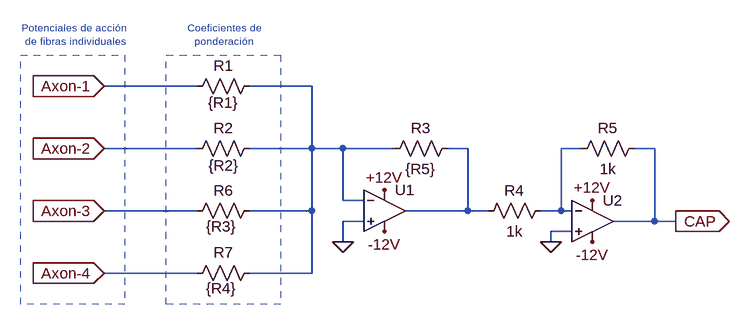
[diagram p0: schematic Modulo-Sumador.asc]
Modulo-Sumador.asc, the LTspice schematic file:
Version 4
SHEET 1 880 680
WIRE -80 64 -224 64
WIRE 96 64 0 64
WIRE -80 160 -224 160
WIRE 96 160 96 64
WIRE 96 160 0 160
WIRE 144 160 96 160
WIRE 224 160 144 160
WIRE 336 160 304 160
WIRE 512 160 480 160
WIRE 624 160 592 160
WIRE 144 240 144 160
WIRE 176 240 144 240
WIRE -80 256 -224 256
WIRE 96 256 96 160
WIRE 96 256 0 256
WIRE 336 256 336 160
WIRE 336 256 240 256
WIRE 368 256 336 256
WIRE 480 256 480 160
WIRE 480 256 448 256
WIRE 496 256 480 256
WIRE 176 272 144 272
WIRE 624 272 624 160
WIRE 624 272 560 272
WIRE 656 272 624 272
WIRE 496 288 464 288
WIRE 144 304 144 272
WIRE 464 304 464 288
WIRE -80 352 -224 352
WIRE 96 352 96 256
WIRE 96 352 0 352
FLAG 144 304 0
FLAG 208 224 +12V
FLAG 208 288 -12V
FLAG 528 240 +12V
FLAG 528 304 -12V
FLAG 464 304 0
FLAG 656 272 CAP
IOPIN 656 272 Out
FLAG -224 64 Axon-1
IOPIN -224 64 In
FLAG -224 160 Axon-2
IOPIN -224 160 In
FLAG -224 256 Axon-3
IOPIN -224 256 In
FLAG -224 352 Axon-4
IOPIN -224 352 In
SYMBOL res 16 48 R90
WINDOW 0 0 56 VBottom 2
WINDOW 3 57 56 VBottom 2
SYMATTR InstName R1
SYMATTR Value {R1}
SYMBOL res 16 144 R90
WINDOW 0 0 56 VBottom 2
WINDOW 3 58 55 VBottom 2
SYMATTR InstName R2
SYMATTR Value {R2}
SYMBOL res 320 144 R90
WINDOW 0 0 56 VBottom 2
WINDOW 3 32 56 VTop 2
SYMATTR InstName R3
SYMATTR Value {R5}
SYMBOL OpAmps\\UniversalOpAmp2 208 256 R0
SYMATTR InstName U1
SYMBOL OpAmps\\UniversalOpAmp2 528 272 R0
SYMATTR InstName U2
SYMBOL res 464 240 R90
WINDOW 0 0 56 VBottom 2
WINDOW 3 32 56 VTop 2
SYMATTR InstName R4
SYMATTR Value 1k
SYMBOL res 608 144 R90
WINDOW 0 0 56 VBottom 2
WINDOW 3 32 56 VTop 2
SYMATTR InstName R5
SYMATTR Value 1k
SYMBOL res 16 240 R90
WINDOW 0 0 56 VBottom 2
WINDOW 3 56 59 VBottom 2
SYMATTR InstName R6
SYMATTR Value {R3}
SYMBOL res 16 336 R90
WINDOW 0 0 56 VBottom 2
WINDOW 3 55 59 VBottom 2
SYMATTR InstName R7
SYMATTR Value {R4}
TEXT -272 -16 Center 1 ;Potenciales de acción\n de fibras individuales
TEXT -40 -16 Center 1 ;Coeficientes de\nponderación
RECTANGLE Normal -192 400 -352 16 1
RECTANGLE Normal 48 400 -128 16 1

The netlist it stands for:
* Modulo-Sumador.asc
R1 N001 Axon-1 {R1}
R2 N001 Axon-2 {R2}
R3 N002 N001 {R5}
XU1 0 N001 +12V -12V N002 level2 Avol=1Meg GBW=10Meg Slew=10Meg Ilimit=25m Rail=0 Vos=0 En=0 Enk=0 In=0 Ink=0 Rin=500Meg  ; pins In+ In- V+ V- OUT
XU2 0 N003 +12V -12V CAP level2 Avol=1Meg GBW=10Meg Slew=10Meg Ilimit=25m Rail=0 Vos=0 En=0 Enk=0 In=0 Ink=0 Rin=500Meg  ; pins In+ In- V+ V- OUT
R4 N003 N002 1k
R5 CAP N003 1k
R6 N001 Axon-3 {R3}
R7 N001 Axon-4 {R4}
* Potenciales de acción
*  de fibras individuales
* Coeficientes de
* ponderación
.lib UniversalOpAmp2.lib
.backanno
.end